# Altium schematic sheet Connector.SchDoc
size A4
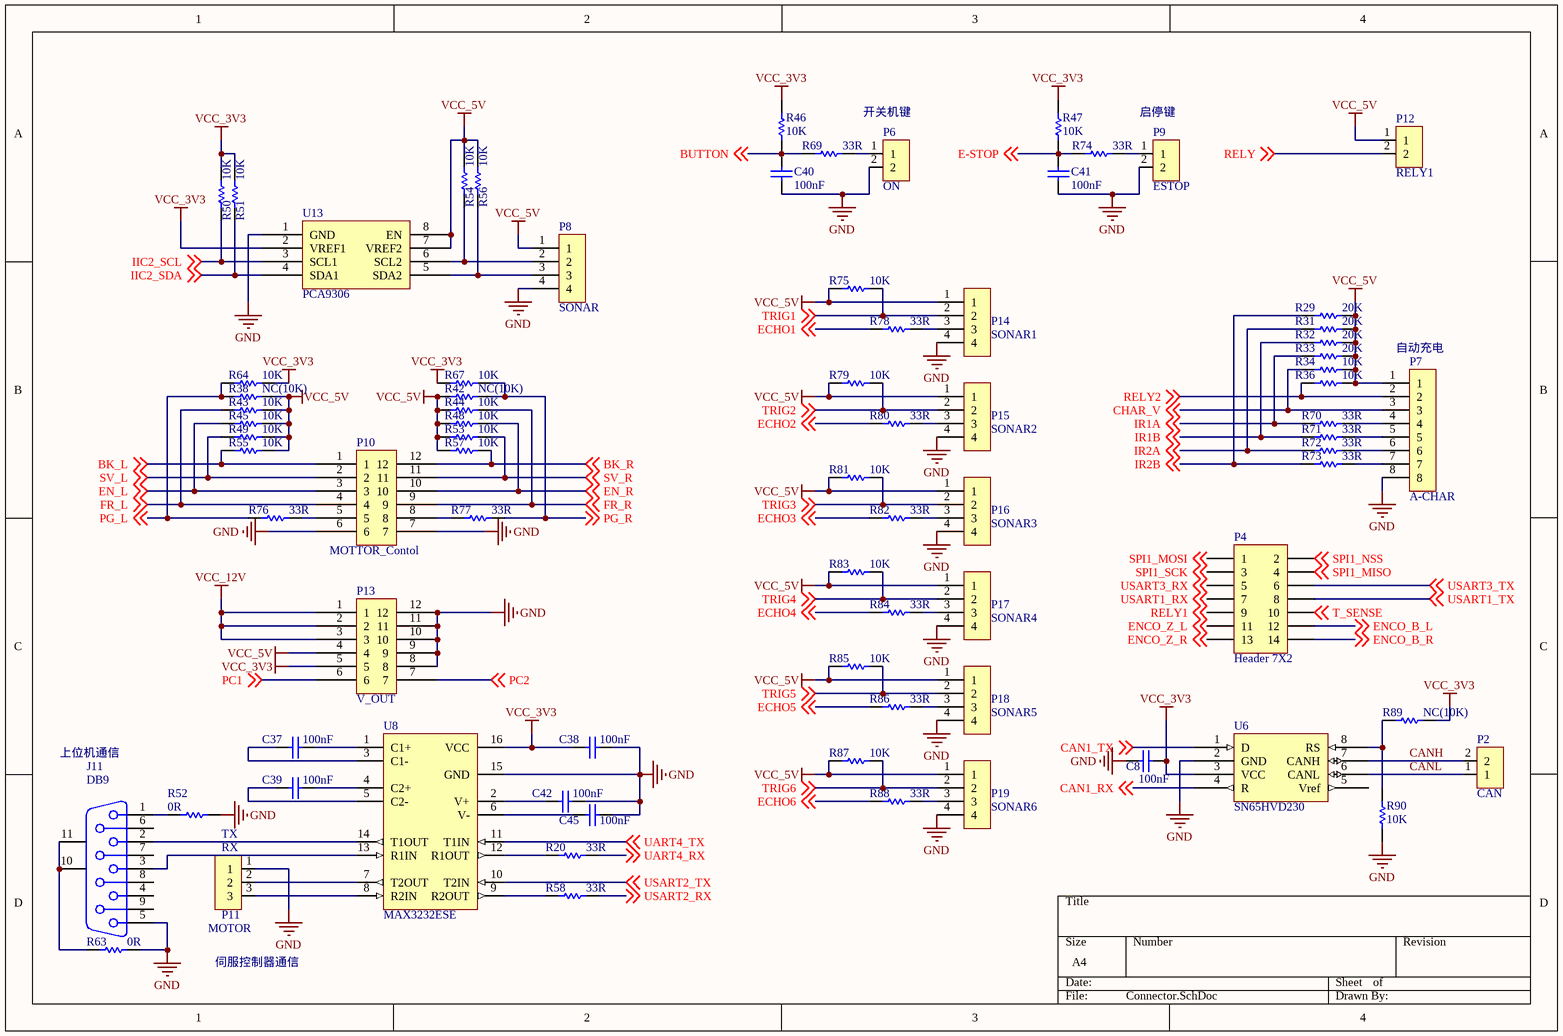
[diagram p0: Connector.SchDoc]

## Parts
C8  value 100nF  [C0805]  (hidden comment: Cap)
C37  value 100nF  [C0805]  (hidden comment: Cap)
C38  value 100nF  [C0805]  (hidden comment: Cap)
C39  value 100nF  [C0805]  (hidden comment: Cap)
C40  value 100nF  [C0805]  (hidden comment: Cap)
C41  value 100nF  [C0805]  (hidden comment: Cap)
C42  value 100nF  [C0805]  (hidden comment: Cap)
C45  value 100nF  [C0805]  (hidden comment: Cap)
J11  DB9  [DB9-TH-F-Z]
P2  CAN  [XH2.54-2P]
P4  Header 7X2  [HDR2X7]
P6  ON  [XH2.54-2P]
P7  A-CHAR  [XH2.54-8P]
P8  SONAR  [XH2.54-4P]
P9  ESTOP  [XH2.54-2P]
P10  MOTTOR_Contol  [PORT-DIP2X6-3-LOCK]
P11  MOTOR  [XH2.54-3P]
P12  RELY1  [XH2.54-2P]
P13  V_OUT  [PORT-DIP2X6-3-LOCK]
P14  SONAR1  [XH2.54-4P]
P15  SONAR2  [XH2.54-4P]
P16  SONAR3  [XH2.54-4P]
P17  SONAR4  [XH2.54-4P]
P18  SONAR5  [XH2.54-4P]
P19  SONAR6  [XH2.54-4P]
R20  value 33R  [R0805]  (hidden comment: Res1)
R29  value 20K  [R0805]  (hidden comment: Res1)
R31  value 20K  [R0805]  (hidden comment: Res1)
R32  value 20K  [R0805]  (hidden comment: Res1)
R33  value 20K  [R0805]  (hidden comment: Res1)
R34  value 10K  [R0805]  (hidden comment: Res1)
R36  value 10K  [R0805]  (hidden comment: Res1)
R38  value NC(10K)  [R0805]  (hidden comment: Res1)
R42  value NC(10K)  [R0805]  (hidden comment: Res1)
R43  value 10K  [R0805]  (hidden comment: Res1)
R44  value 10K  [R0805]  (hidden comment: Res1)
R45  value 10K  [R0805]  (hidden comment: Res1)
R46  value 10K  [R0805]  (hidden comment: Res1)
R47  value 10K  [R0805]  (hidden comment: Res1)
R48  value 10K  [R0805]  (hidden comment: Res1)
R49  value 10K  [R0805]  (hidden comment: Res1)
R50  value 10K  [R0805]  (hidden comment: Res1)
R51  value 10K  [R0805]  (hidden comment: Res1)
R52  value 0R  [R0805]  (hidden comment: Res1)
R53  value 10K  [R0805]  (hidden comment: Res1)
R54  value 10K  [R0805]  (hidden comment: Res1)
R55  value 10K  [R0805]  (hidden comment: Res1)
R56  value 10K  [R0805]  (hidden comment: Res1)
R57  value 10K  [R0805]  (hidden comment: Res1)
R58  value 33R  [R0805]  (hidden comment: Res1)
R63  value 0R  [R0805]  (hidden comment: Res1)
R64  value 10K  [R0805]  (hidden comment: Res1)
R67  value 10K  [R0805]  (hidden comment: Res1)
R69  value 33R  [R0805]  (hidden comment: Res1)
R70  value 33R  [R0805]  (hidden comment: Res1)
R71  value 33R  [R0805]  (hidden comment: Res1)
R72  value 33R  [R0805]  (hidden comment: Res1)
R73  value 33R  [R0805]  (hidden comment: Res1)
R74  value 33R  [R0805]  (hidden comment: Res1)
R75  value 10K  [R0805]  (hidden comment: Res1)
R76  value 33R  [R0805]  (hidden comment: Res1)
R77  value 33R  [R0805]  (hidden comment: Res1)
R78  value 33R  [R0805]  (hidden comment: Res1)
R79  value 10K  [R0805]  (hidden comment: Res1)
R80  value 33R  [R0805]  (hidden comment: Res1)
R81  value 10K  [R0805]  (hidden comment: Res1)
R82  value 33R  [R0805]  (hidden comment: Res1)
R83  value 10K  [R0805]  (hidden comment: Res1)
R84  value 33R  [R0805]  (hidden comment: Res1)
R85  value 10K  [R0805]  (hidden comment: Res1)
R86  value 33R  [R0805]  (hidden comment: Res1)
R87  value 10K  [R0805]  (hidden comment: Res1)
R88  value 33R  [R0805]  (hidden comment: Res1)
R89  value NC(10K)  [R0805]  (hidden comment: Res1)
R90  value 10K  [R0805]  (hidden comment: Res1)
U6  SN65HVD230  [SO8-SN65HVD230]
U8  MAX3232ESE  [SOP16]
U13  PCA9306  [ACS712-SOIC8]

## Nets
GND: C8.1 C38.1 C40.2 C41.2 C42.1 C45.1 J11.5 P6.2 P7.8 P8.4 P9.2 P10.6 P10.7 P11.1 P13.8 P13.9 P13.10 P13.11 P13.12 P14.4 P15.4 P16.4 P17.4 P18.4 P19.4 R52.1 R63.1 R90.2 U6.2(GND) U8.15(GND) U13.1(GND)
VCC_3V3: C8.2 C38.2 P13.5 R46.2 R47.2 R50.2 R51.2 R64.2 R67.1 R89.1 U6.3(VCC) U8.16(VCC) U13.2(VREF1)
VCC_5V: P7.1 P8.1 P12.1 P13.4 P14.1 P15.1 P16.1 P17.1 P18.1 P19.1 R29.1 R31.1 R32.1 R33.1 R34.1 R36.1 R38.2 R42.1 R43.2 R44.1 R45.2 R48.1 R49.2 R53.1 R54.1 R55.2 R56.1 R57.1 R75.2 R79.2 R81.2 R83.2 R85.2 R87.2 U13.7(VREF2) U13.8(EN)
VCC_12V: P13.1 P13.2 P13.3
BK_L: P10.1 R55.1 ; off-sheet BK_L
BK_R: P10.12 R57.2 ; off-sheet BK_R
BUTTON: C40.1 R46.1 R69.2 ; off-sheet BUTTON
CAN1_RX: U6.4(R) ; off-sheet CAN1_RX
CAN1_TX: U6.1(D) ; off-sheet CAN1_TX
CANH: P2.2 U6.7(CANH)
CANL: P2.1 U6.6(CANL)
CHAR_V: P7.3 R34.2 ; off-sheet CHAR_V
E-STOP: C41.1 R47.1 R74.2 ; off-sheet E-STOP
ECHO1: R78.2 ; off-sheet ECHO1
ECHO2: R80.2 ; off-sheet ECHO2
ECHO3: R82.2 ; off-sheet ECHO3
ECHO4: R84.2 ; off-sheet ECHO4
ECHO5: R86.2 ; off-sheet ECHO5
ECHO6: R88.2 ; off-sheet ECHO6
EN_L: P10.3 R45.1 ; off-sheet EN_L
EN_R: P10.10 R48.2 ; off-sheet EN_R
ENCO_B_L: P4.12 ; off-sheet ENCO_B_L
ENCO_B_R: P4.14 ; off-sheet ENCO_B_R
ENCO_Z_L: P4.11 ; off-sheet ENCO_Z_L
ENCO_Z_R: P4.13 ; off-sheet ENCO_Z_R
FR_L: P10.4 R43.1 ; off-sheet FR_L
FR_R: P10.9 R44.2 ; off-sheet FR_R
IIC2_SCL: R50.1 U13.3(SCL1) ; off-sheet IIC2_SCL
IIC2_SDA: R51.1 U13.4(SDA1) ; off-sheet IIC2_SDA
IR1A: R33.2 R70.2 ; off-sheet IR1A
IR1B: R32.2 R71.2 ; off-sheet IR1B
IR2A: R31.2 R72.2 ; off-sheet IR2A
IR2B: R29.2 R73.2 ; off-sheet IR2B
PC1: P13.6 ; off-sheet PC1
PC2: P13.7 ; off-sheet PC2
PG_L: R38.1 R64.1 R76.2 ; off-sheet PG_L
PG_R: R42.2 R67.2 R77.1 ; off-sheet PG_R
RELY: P12.2 ; off-sheet RELY
RELY1: P4.9 ; off-sheet RELY1
RELY2: P7.2 R36.2 ; off-sheet RELY2
SPI1_MISO: P4.4 ; off-sheet SPI1_MISO
SPI1_MOSI: P4.1 ; off-sheet SPI1_MOSI
SPI1_NSS: P4.2 ; off-sheet SPI1_NSS
SPI1_SCK: P4.3 ; off-sheet SPI1_SCK
SV_L: P10.2 R49.1 ; off-sheet SV_L
SV_R: P10.11 R53.2 ; off-sheet SV_R
T_SENSE: P4.10 ; off-sheet T_SENSE
TRIG1: P14.2 R75.1 ; off-sheet TRIG1
TRIG2: P15.2 R79.1 ; off-sheet TRIG2
TRIG3: P16.2 R81.1 ; off-sheet TRIG3
TRIG4: P17.2 R83.1 ; off-sheet TRIG4
TRIG5: P18.2 R85.1 ; off-sheet TRIG5
TRIG6: P19.2 R87.1 ; off-sheet TRIG6
UART4_RX: R20.2 ; off-sheet UART4_RX
UART4_TX: U8.11(T1IN) ; off-sheet UART4_TX
USART1_RX: P4.7 ; off-sheet USART1_RX
USART1_TX: P4.8 ; off-sheet USART1_TX
USART2_RX: R58.2 ; off-sheet USART2_RX
USART2_TX: U8.10(T2IN) ; off-sheet USART2_TX
USART3_RX: P4.5 ; off-sheet USART3_RX
USART3_TX: P4.6 ; off-sheet USART3_TX
NetC37_1: C37.1 U8.1(C1+)
NetC37_2: C37.2 U8.3(C1-)
NetC39_1: C39.1 U8.4(C2+)
NetC39_2: C39.2 U8.5(C2-)
NetC42_2: C42.2 U8.2(V+)
NetC45_2: C45.2 U8.6(V-)
NetJ11_1: J11.1 R52.2
NetJ11_2: J11.2 U8.14(T1OUT)
NetJ11_3: J11.3 U8.13(R1IN)
NetJ11_10: J11.10(MH1) J11.11(MH2) R63.2
NetP6_1: P6.1 R69.1
NetP7_4: P7.4 R70.1
NetP7_5: P7.5 R71.1
NetP7_6: P7.6 R72.1
NetP7_7: P7.7 R73.1
NetP8_2: P8.2 R54.2 U13.6(SCL2)
NetP8_3: P8.3 R56.2 U13.5(SDA2)
NetP9_1: P9.1 R74.1
NetP10_5: P10.5 R76.1
NetP10_8: P10.8 R77.2
NetP11_2: P11.2 U8.7(T2OUT)
NetP11_3: P11.3 U8.8(R2IN)
NetP14_3: P14.3 R78.1
NetP15_3: P15.3 R80.1
NetP16_3: P16.3 R82.1
NetP17_3: P17.3 R84.1
NetP18_3: P18.3 R86.1
NetP19_3: P19.3 R88.1
NetR20_1: R20.1 U8.12(R1OUT)
NetR58_1: R58.1 U8.9(R2OUT)
NetR89_2: R89.2 R90.1 U6.8(RS)

Not connected (* = marked no-connect by the designer): J11 4 6 7 8 9; U6 5(Vref)

## Notes on the sheet
- 开关机键
- 启停键
- (near P7) 自动充电
- 上位机通信
- TX
- (near P11) RX
- 伺服控制器通信

## Library data of the parts
C8 C37-C42 C45 = Cap: Capacitor; Published: 8-Jun-2000; LatestRevisionDate: 17-Jul-2002; LatestRevisionNote: Re-released for DXP Platform.; PackageReference: RAD-0.3; Publisher: Altium Limited; PackageDescription: Radial Cap, Thru-Hole; 2 Leads; 0.3 in Pin Spacing
J11 = D Connector 9: 串口; PackageDocument: O; Positions: 9; Gender: Receptacle; Published: 15-Jun-2001; LatestRevisionDate: 17-Jul-2002; LatestRevisionNote: Re-released for DXP Platform.; DatasheetDocument: 1-Sep-1999; PackageReference: 788750; Publisher: Altium Limited; Orientation: Right Angle
P2 P6 P9 P12 = Conn_1*2
P4 = Header 7X2: Header, 7-Pin, Dual row; LatestRevisionDate: 17-Jul-2002; LatestRevisionNote: Re-released for DXP Platform.; Publisher: Altium Limited
P7 = Conn_1*8
P8 P14-P19 = Conn_1*4_1
P10 P13 = Conn_2*6
P11 = Conn_1*3
R20 R29 R31-R34 R36 R38 R42-R58 R63 R64 R67 R69-R90 = Res1: Resistor; Published: 8-Jun-2000; LatestRevisionDate: 17-Jul-2002; LatestRevisionNote: Re-released for DXP Platform.; PackageReference: AXIAL-0.3; Publisher: Altium Limited; PackageDescription: Axial Device, Thru-Hole; 2 Leads; 0.3 in Pin Spacing
U6 = SN65HVD230D
U8 = MAX3232ESE: +5V Powered, Multi-Channel RS-232 Driver/Receiver; Published: 16-Jan-2001; LatestRevisionDate: 29-May-2009; LatestRevisionNote: Component Body Added.; PackageVersion: 1997; PackageReference: PE16A; Publisher: Altium Limited; PackageDescription: DIP, 16-Pin, Row Spacing 7.62 mm, Pitch 2.54 mm; Code_JEDEC: MS-001-BB; ComponentLink1Description: Manufacturer Link; ComponentLink1URL: http://www.maxim-ic.com/; ComponentLink2Description: Datasheet; ComponentLink2URL: http://pdfserv.maxim-ic.com/en/ds/MAX220-MAX249.pdf